# EAGLE schematic brick_i2c_7seg (EAGLE 7.4.0)
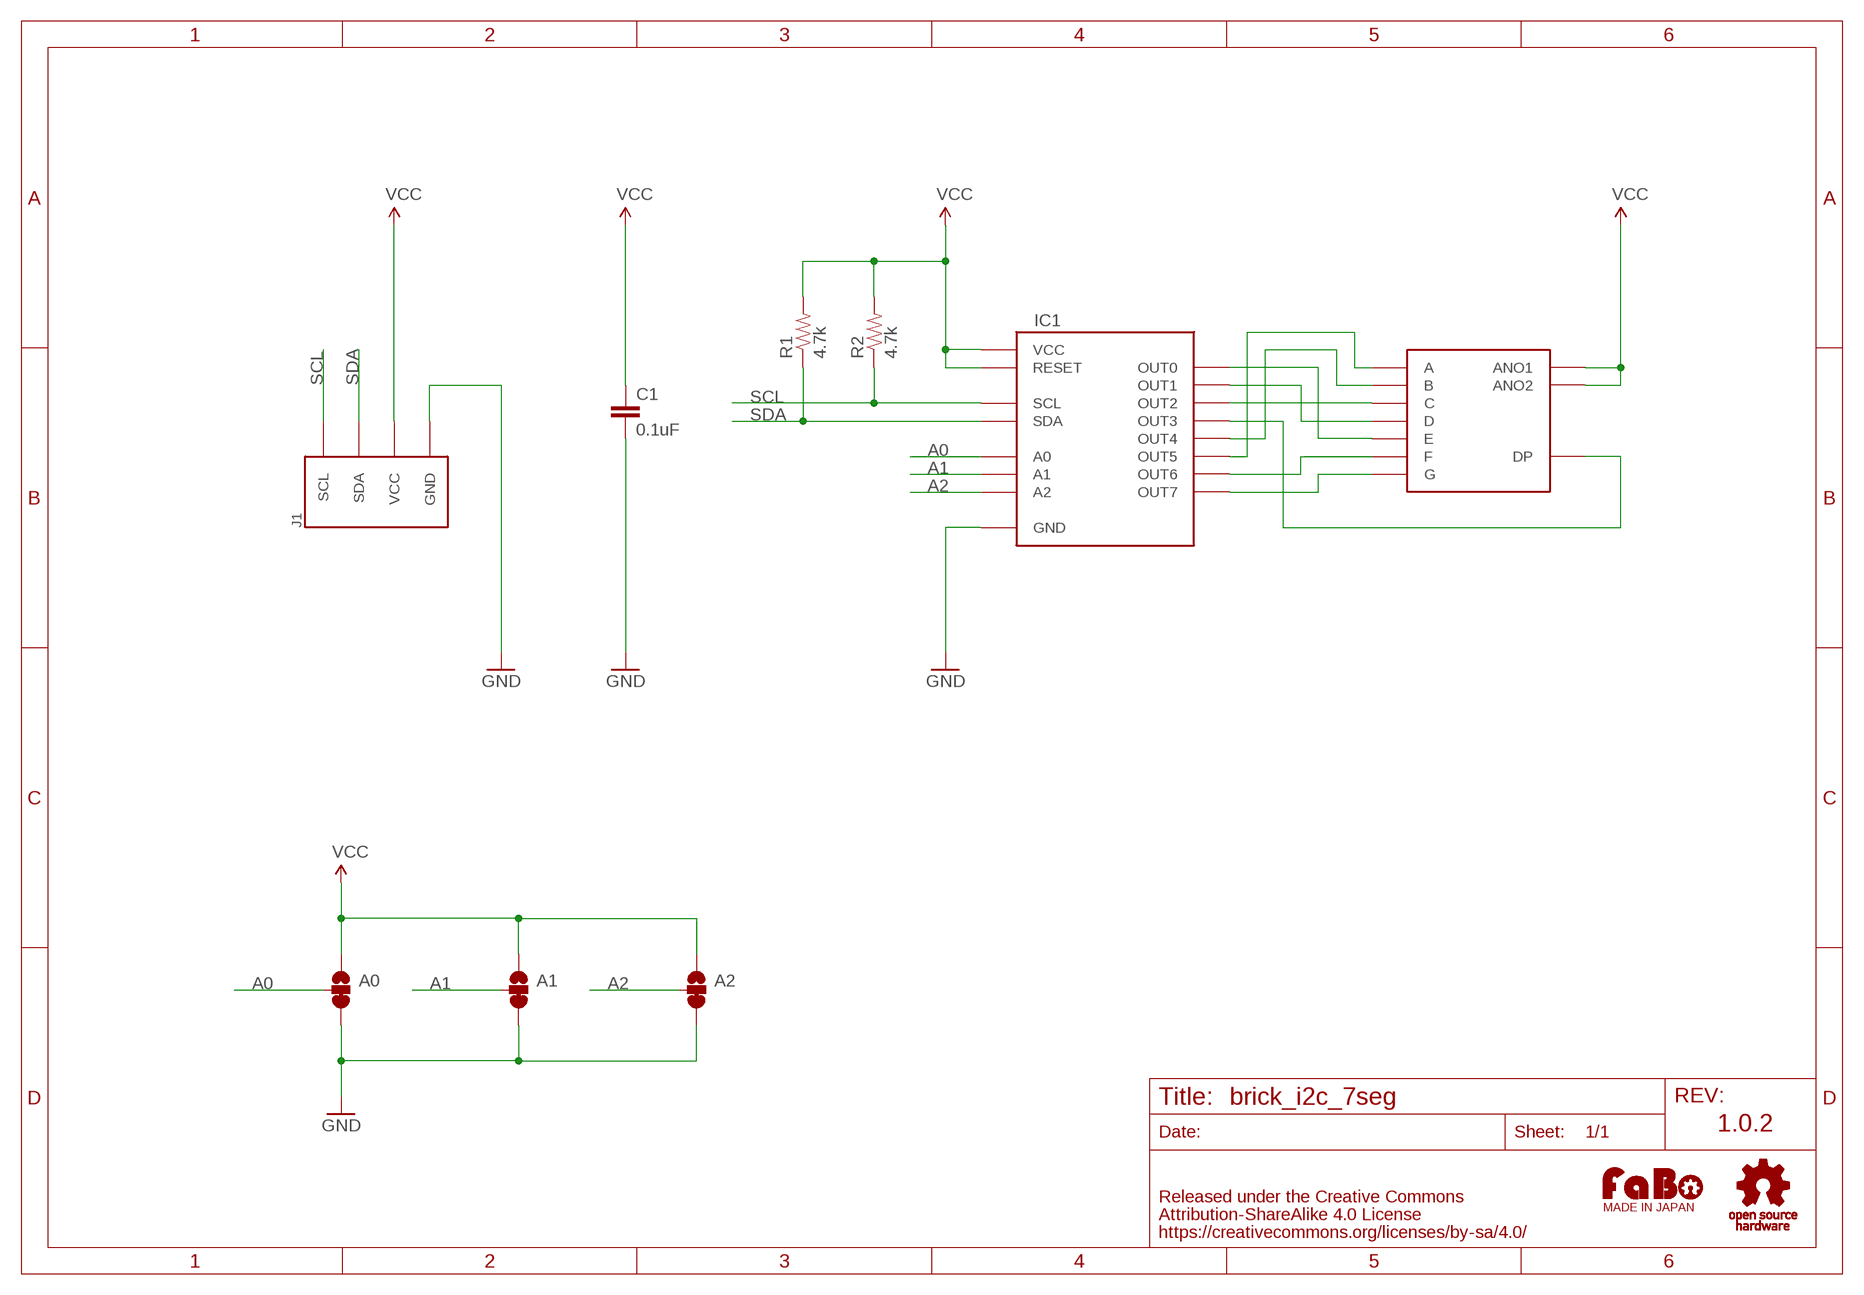
[diagram p0: schematic, sheet 1]

## Parts
A0  SMD-JUMPER-3-23SHORT  [SMD-JUMPER-3]
A1  SMD-JUMPER-3-23SHORT  [SMD-JUMPER-3]
A2  SMD-JUMPER-3-23SHORT  [SMD-JUMPER-3]
C1  0.1uF  CAP-EIA0603  [EIA0603]
IC1  TLC59208F  [TSSOP16]
J1  BRICK_I2C  [BRICK_I2C]
R1  4.7k  RES-EIA0603  [EIA0603]
R2  4.7k  RES-EIA0603  [EIA0603]
U$2  A-551SRD  [A-551SRD]
U$3  LOGO_FABO-M  [LOGO_FABO_M]
U$4  LOGO_OSHW_T-BT  [LOGO_OSHW_T_M_BOTTOM]

## Nets
A0: A0.2 IC1.1(A0)
A1: A1.2 IC1.2(A1)
A2: A2.2 IC1.3(A2)
GND: A0.3 A1.3 A2.3 C1.2 IC1.8(GND) J1.GND
N$1: IC1.4(OUT0) U$2.E
N$2: IC1.5(OUT1) U$2.D
N$3: IC1.6(OUT2) U$2.C
N$4: IC1.7(OUT3) U$2.DP
N$5: IC1.9(OUT4) U$2.B
N$6: IC1.10(OUT5) U$2.A
N$7: IC1.11(OUT6) U$2.F
N$8: IC1.12(OUT7) U$2.G
SCL: IC1.14(SCL) J1.SCL R2.1
SDA: IC1.15(SDA) J1.SDA R1.1
VCC: A0.1 A1.1 A2.1 C1.1 IC1.13(RESET) IC1.16(VCC) J1.VCC R1.2 R2.2 U$2.ANO1 U$2.ANO2

## Notes on the sheet
- 1.0.2

## Library data of the parts
A0 A1 A2 = GClue:SMD-JUMPER-3-23SHORT
C1 = GClue:CAP: Capacitor Standard 0603 ceramic capacitor
IC1 = GClue:TLC59208F
J1 = GClue:BRICK_I2C: FaBo Brick 4pin(I2C)
R1 R2 = GClue:RES
U$2 = GClue:A-551SRD
U$3 = FaBo:LOGO_FABO
U$4 = GClue:LOGO_OSHW_T